# Altium schematic sheet schematic.SchDoc
size A4
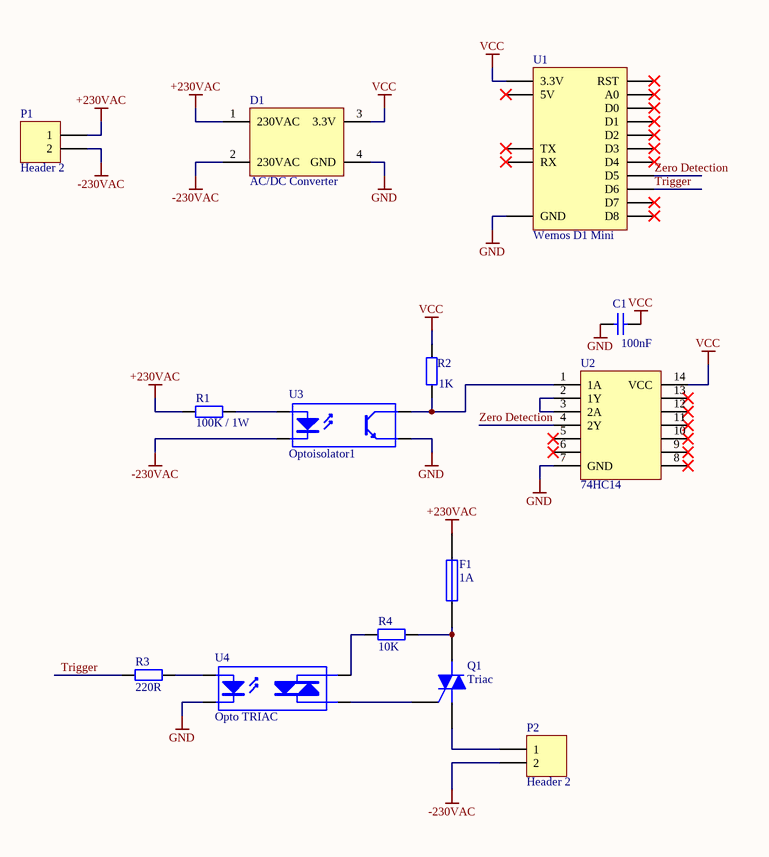
[diagram p0: schematic.SchDoc]

## Parts
C1  value 100nF  [RAD-0.3]  (hidden comment: Cap)
D1  AC/DC Converter  [D-46_6A]
F1  1A  [PIN-W2/E2.8]
P1  Header 2  [HDR1X2]
P2  Header 2  [HDR1X2]
Q1  Triac  [369-03]
R1  value 100K / 1W  [AXIAL-0.4]  (hidden comment: Res2)
R2  value 1K  [AXIAL-0.4]  (hidden comment: Res2)
R3  value 220R  [AXIAL-0.4]  (hidden comment: Res2)
R4  value 10K  [AXIAL-0.4]  (hidden comment: Res2)
U1  Wemos D1 Mini
U2  74HC14  [SOT403-1_L]
U3  Optoisolator1  [DIP-4]
U4  Opto TRIAC  [NPSIP4A]

## Nets
+230VAC: D1.1(230VAC) F1.2 P1.1 R1.1
-230VAC: D1.2(230VAC) P1.2 P2.2 U3.2(K)
GND: C1.1 D1.4(GND) U1.7(GND) U2.7(GND) U3.3(E) U4.2(K)
VCC: C1.2 D1.3(3.3V) R2.2 U1.9(3.3V) U2.14(VCC)
Trigger: R3.1 U1.12(D6)
Zero Detection: U1.13(D5) U2.4(2Y)
NetF1_1: F1.1 Q1.2(M2) R4.2
NetP2_1: P2.1 Q1.1(M1)
NetQ1_3: Q1.3(G) U4.4(A/K)
NetR1_2: R1.2 U3.1(A)
NetR2_1: R2.1 U2.1(1A) U3.4(C)
NetR3_2: R3.2 U4.1(A)
NetR4_1: R4.1 U4.3(A/K)
NetU2_2: U2.2(1Y) U2.3(2A)

Not connected (* = marked no-connect by the designer): U1 1(TX)* 2(RX)* 3(D1)* 4(D2)* 5(D3)* 6(D4)* 8(5V)* 10(D8)* 11(D7)* 14(D0)* 15(A0)* 16(RST)*; U2 5* 6* 8* 9* 10* 11* 12* 13*

## Library data of the parts
C1 = Cap: Capacitor; Published: 8-Jun-2000; LatestRevisionDate: 17-Jul-2002; LatestRevisionNote: Re-released for DXP Platform.; PackageReference: RAD-0.3; Publisher: Altium Limited; PackageDescription: Radial Cap, Thru-Hole; 2 Leads; 0.3 in Pin Spacing
F1 = Fuse 1: Fuse; Published: 8-Jun-2000; LatestRevisionDate: 17-Jul-2002; LatestRevisionNote: Re-released for DXP Platform.; PackageReference: PIN-W2/E2.8; Publisher: Altium Limited; PackageDescription: Thru-Hole; 2 Leads
P1 P2 = Header 2: Header, 2-Pin; LatestRevisionDate: 17-Jul-2002; LatestRevisionNote: Re-released for DXP Platform.; Publisher: Altium Limited
Q1 = Triac: Silicon Bidirectional Triode Thyristor; Note: Pin 2 is electrically connected to Pin 4 (TAB); Published: 29-Sep-2000; LatestRevisionDate: 17-Jul-2002; LatestRevisionNote: Re-released for DXP Platform.; DatasheetVersion: 1999; PackageReference: 369-03; Publisher: Altium Limited; PackageDescription: TO, Thru-Hole, Vertical, Heatsink Mounted; 3 In-Line Leads; Pitch 2.28 mm; ComponentLink1Description: Manufacturer Link; ComponentLink1URL: http://www.motorola.com/
R1-R4 = Res2: Resistor; Published: 8-Jun-2000; LatestRevisionDate: 17-Jul-2002; LatestRevisionNote: Re-released for DXP Platform.; PackageReference: AXIAL-0.4; Publisher: Altium Limited; PackageDescription: Axial Device, Thru-Hole; 2 Leads; 0.4 in Pin Spacing
U1 = WemosD1Mini
U2 = Schmitt-Trigger 74HC14: Generic 8-Bit A/D Converter; Published: 8-Jun-2000; LatestRevisionDate: 29-May-2009; LatestRevisionNote: IPC-7351 Footprint Added.; PackageVersion: Mar-2002; PackageReference: SOT403-1; Publisher: Altium Limited; PackageDescription: 16-Pin Thin Small Outline Package 0.65 mm Pitch; Code_JEDEC: MO-153
U3 = Optoisolator1: 4-Pin Phototransistor Optocoupler; Published: 24-Mar-1999; LatestRevisionDate: 04-Mar-2005; LatestRevisionNote: Sch pins 3 & 4 Swapped.; DatasheetVersion: Nov-2003; PackageReference: DIP-4; Publisher: Altium Limited
U4 = Opto TRIAC: Opto-Triac; Published: 24-Mar-1999; LatestRevisionDate: 17-Jul-2002; LatestRevisionNote: Re-released for DXP Platform.; PackageReference: NPSIP4A; Publisher: Altium Limited; PackageDescription: SIP; 4 Leads; Body 10 x 11.5 x 7.5 mm (typ); Pitch 2.54 mm
D1 = AC/DC Converter: Published: 24-Mar-1999; LatestRevisionDate: 17-Jul-2002; LatestRevisionNote: Re-released for DXP Platform.; PackageReference: D-46_6A; Publisher: Altium Limited; PackageDescription: Bridge Rectifier; 4 Terminals; Body 16.8 x 16.8 mm (typ); Pitch 10.67 mm